# EAGLE schematic Freqy Lights Pro (EAGLE 6.6.0)
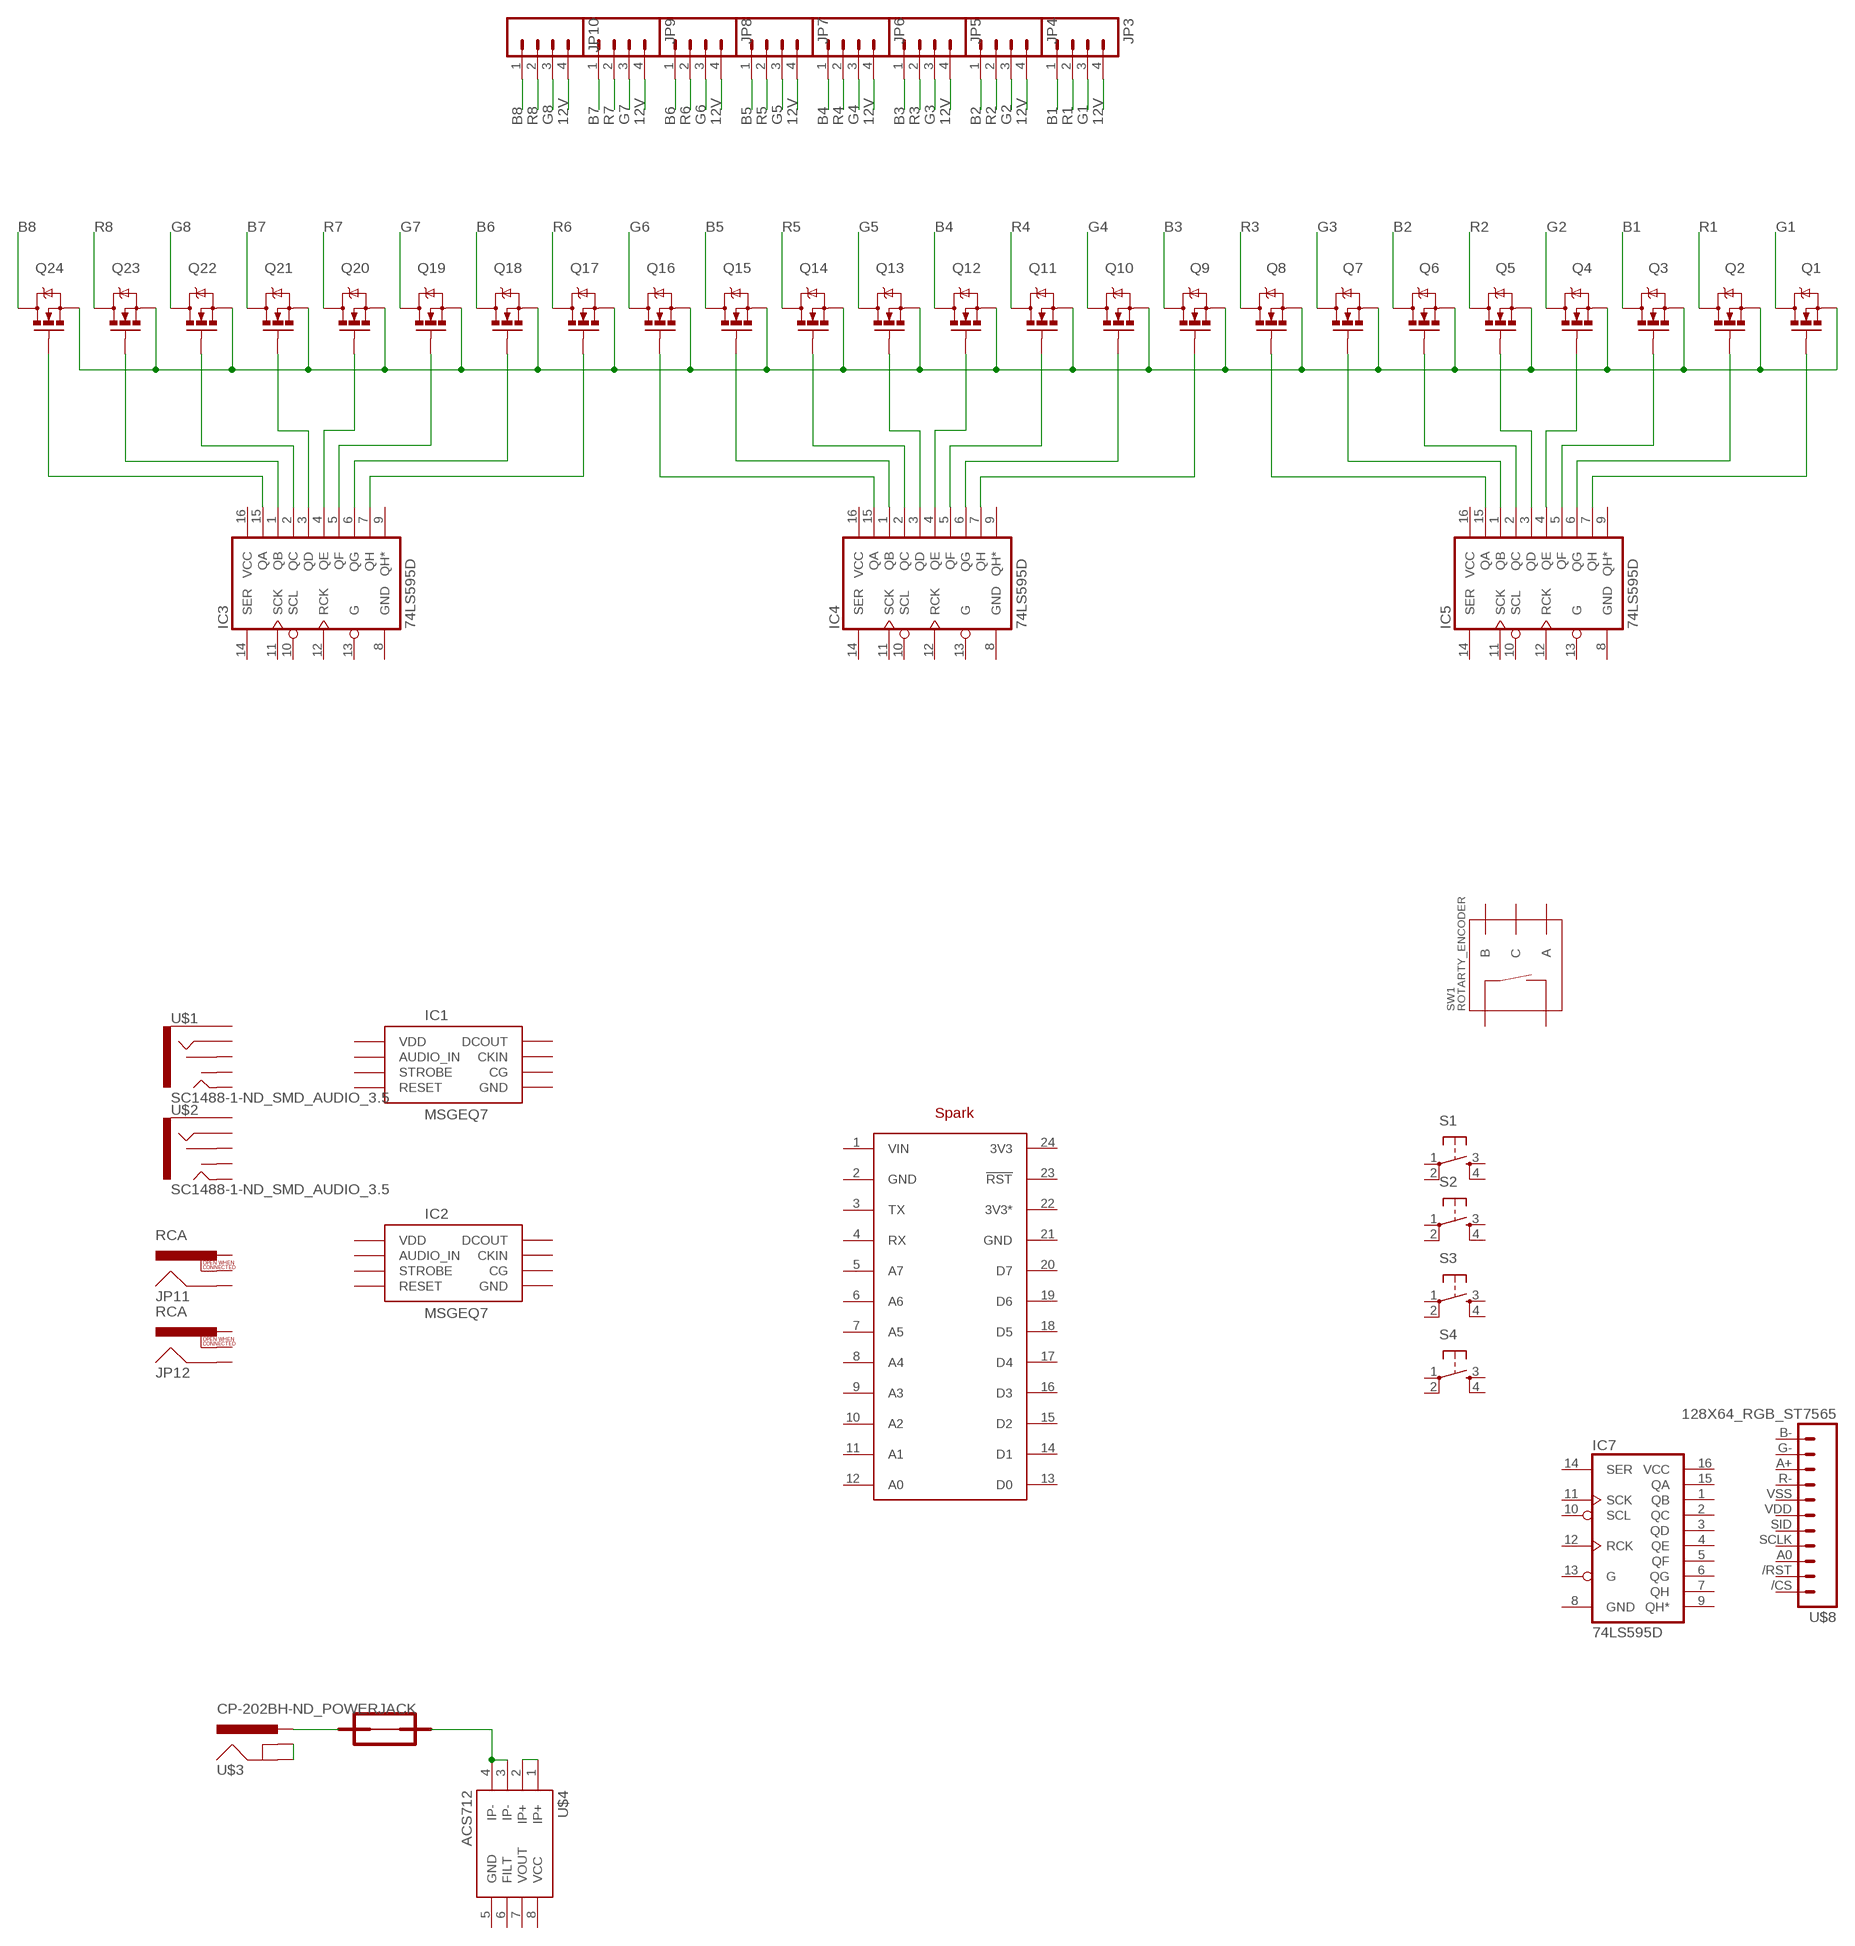
[diagram p0: schematic, sheet 1]

## Parts
IC1  MSGEQ7SOIC  [SOIC8]
IC2  MSGEQ7SOIC  [SOIC8]
IC3  74LS595D  [SO16]
IC4  74LS595D  [SO16]
IC5  74LS595D  [SO16]
IC7  74LS595D  [SO16]
JP3  M04SCREW  [SCREWTERMINAL-3.5MM-4]
JP4  M04SCREW  [SCREWTERMINAL-3.5MM-4]
JP5  M04SCREW  [SCREWTERMINAL-3.5MM-4]
JP6  M04SCREW  [SCREWTERMINAL-3.5MM-4]
JP7  M04SCREW  [SCREWTERMINAL-3.5MM-4]
JP8  M04SCREW  [SCREWTERMINAL-3.5MM-4]
JP9  M04SCREW  [SCREWTERMINAL-3.5MM-4]
JP10  M04SCREW  [SCREWTERMINAL-3.5MM-4]
JP11  RCA  [RCA]
JP12  RCA  [RCA]
Q1  MOSFET-NCHANNELBSS123LT1G  [SOT23]
Q2  MOSFET-NCHANNELBSS123LT1G  [SOT23]
Q3  MOSFET-NCHANNELBSS123LT1G  [SOT23]
Q4  MOSFET-NCHANNELBSS123LT1G  [SOT23]
Q5  MOSFET-NCHANNELBSS123LT1G  [SOT23]
Q6  MOSFET-NCHANNELBSS123LT1G  [SOT23]
Q7  MOSFET-NCHANNELBSS123LT1G  [SOT23]
Q8  MOSFET-NCHANNELBSS123LT1G  [SOT23]
Q9  MOSFET-NCHANNELBSS123LT1G  [SOT23]
Q10  MOSFET-NCHANNELBSS123LT1G  [SOT23]
Q11  MOSFET-NCHANNELBSS123LT1G  [SOT23]
Q12  MOSFET-NCHANNELBSS123LT1G  [SOT23]
Q13  MOSFET-NCHANNELBSS123LT1G  [SOT23]
Q14  MOSFET-NCHANNELBSS123LT1G  [SOT23]
Q15  MOSFET-NCHANNELBSS123LT1G  [SOT23]
Q16  MOSFET-NCHANNELBSS123LT1G  [SOT23]
Q17  MOSFET-NCHANNELBSS123LT1G  [SOT23]
Q18  MOSFET-NCHANNELBSS123LT1G  [SOT23]
Q19  MOSFET-NCHANNELBSS123LT1G  [SOT23]
Q20  MOSFET-NCHANNELBSS123LT1G  [SOT23]
Q21  MOSFET-NCHANNELBSS123LT1G  [SOT23]
Q22  MOSFET-NCHANNELBSS123LT1G  [SOT23]
Q23  MOSFET-NCHANNELBSS123LT1G  [SOT23]
Q24  MOSFET-NCHANNELBSS123LT1G  [SOT23]
S1  TAC_SWITCHPTH  [TACTILE-PTH]
S2  TAC_SWITCHPTH  [TACTILE-PTH]
S3  TAC_SWITCHPTH  [TACTILE-PTH]
S4  TAC_SWITCHPTH  [TACTILE-PTH]
SW1  ROTARTY_ENCODER  [ROTARY_ENC_PLAIN]
U$1  SC1488-1-ND_SMD_AUDIO_3.5  [3.5MM_SMD_AUDIO_SC1488-1-ND]
U$2  SC1488-1-ND_SMD_AUDIO_3.5  [3.5MM_SMD_AUDIO_SC1488-1-ND]
U$3  CP-202BH-ND_POWERJACK  [POWER_JACK_CP-202BH-ND]
U$4  ACS712  [SO08]
U$5  SSQ12  [SSQ12]
U$8  128X64_RGB_ST7565  [ST7565_128X64_RGB]
U$9  SPARK_LOGO_WITH_PLANE  [SPARK_LOGO_PLUS_PLANE]
U$10  SPARK_CORECORE  [SPARK_CORE]

## Nets
12V: JP3.4 JP4.4 JP5.4 JP6.4 JP7.4 JP8.4 JP9.4 JP10.4
B1: JP3.1 Q3.3(D)
B2: JP4.1 Q6.3(D)
B3: JP5.1 Q9.3(D)
B4: JP6.1 Q12.3(D)
B5: JP7.1 Q15.3(D)
B6: JP8.1 Q18.3(D)
B7: JP9.1 Q21.3(D)
B8: JP10.1 Q24.3(D)
G1: JP3.3 Q1.3(D)
G2: JP4.3 Q4.3(D)
G3: JP5.3 Q7.3(D)
G4: JP6.3 Q10.3(D)
G5: JP7.3 Q13.3(D)
G6: JP8.3 Q16.3(D)
G7: JP9.3 Q19.3(D)
G8: JP10.3 Q22.3(D)
N$1: Q1.2(S) Q2.2(S) Q3.2(S) Q4.2(S) Q5.2(S) Q6.2(S) Q7.2(S) Q8.2(S) Q9.2(S) Q10.2(S) Q11.2(S) Q12.2(S) Q13.2(S) Q14.2(S) Q15.2(S) Q16.2(S) Q17.2(S) Q18.2(S) Q19.2(S) Q20.2(S) Q21.2(S) Q22.2(S) Q23.2(S) Q24.2(S)
N$2: U$3.PWR U$5.P$1
N$3: U$3.GND U$3.GNDBRK(GNDBREAK)
N$5: U$4.3(IP-) U$4.4(IP-) U$5.P$2
N$6: IC3.15(QA) Q24.1(G)
N$7: IC3.1(QB) Q23.1(G)
N$8: IC3.2(QC) Q22.1(G)
N$9: IC3.3(QD) Q21.1(G)
N$10: IC3.4(QE) Q20.1(G)
N$11: IC3.5(QF) Q19.1(G)
N$12: IC3.6(QG) Q18.1(G)
N$13: IC3.7(QH) Q17.1(G)
N$14: IC4.3(QD) Q13.1(G)
N$15: IC4.4(QE) Q12.1(G)
N$16: IC5.3(QD) Q5.1(G)
N$17: IC5.4(QE) Q4.1(G)
N$18: IC4.15(QA) Q16.1(G)
N$19: IC4.1(QB) Q15.1(G)
N$20: IC4.2(QC) Q14.1(G)
N$21: IC4.5(QF) Q11.1(G)
N$22: IC4.6(QG) Q10.1(G)
N$23: IC4.7(QH) Q9.1(G)
N$24: IC5.15(QA) Q8.1(G)
N$25: IC5.1(QB) Q7.1(G)
N$26: IC5.2(QC) Q6.1(G)
N$27: IC5.7(QH) Q1.1(G)
N$28: IC5.6(QG) Q2.1(G)
N$29: IC5.5(QF) Q3.1(G)
N$30: U$4.1(IP+) U$4.2(IP+)
R1: JP3.2 Q2.3(D)
R2: JP4.2 Q5.3(D)
R3: JP5.2 Q8.3(D)
R4: JP6.2 Q11.3(D)
R5: JP7.2 Q14.3(D)
R6: JP8.2 Q17.3(D)
R7: JP9.2 Q20.3(D)
R8: JP10.2 Q23.3(D)
Unconnected: IC1.1(VDD) IC1.2(GND) IC1.3(DCOUT) IC1.4(STROBE) IC1.5(AUDIO_IN) IC1.6(CG) IC1.7(RESET) IC1.8(CKIN) IC2.1(VDD) IC2.2(GND) IC2.3(DCOUT) IC2.4(STROBE) IC2.5(AUDIO_IN) IC2.6(CG) IC2.7(RESET) IC2.8(CKIN) IC3.9(QH*) IC3.10(SCL) IC3.11(SCK) IC3.12(RCK) IC3.13(G) IC3.14(SER) IC4.9(QH*) IC4.10(SCL) IC4.11(SCK) IC4.12(RCK) IC4.13(G) IC4.14(SER) IC5.9(QH*) IC5.10(SCL) IC5.11(SCK) IC5.12(RCK) IC5.13(G) IC5.14(SER) IC7.1(QB) IC7.2(QC) IC7.3(QD) IC7.4(QE) IC7.5(QF) IC7.6(QG) IC7.7(QH) IC7.9(QH*) IC7.10(SCL) IC7.11(SCK) IC7.12(RCK) IC7.13(G) IC7.14(SER) IC7.15(QA) JP11.PIN JP11.SHELL JP11.SWITCH JP12.PIN JP12.SHELL JP12.SWITCH S1.1 S1.2 S1.3 S1.4 S2.1 S2.2 S2.3 S2.4 S3.1 S3.2 S3.3 S3.4 S4.1 S4.2 S4.3 S4.4 SW1.A SW1.B SW1.C SW1.SW+ SW1.SW- U$1.RING U$1.RSH U$1.SLEEVE U$1.TIP U$1.TSH U$2.RING U$2.RSH U$2.SLEEVE U$2.TIP U$2.TSH U$4.5(GND) U$4.6(FILT) U$4.7(VOUT) U$4.8(VCC) U$8./CS U$8./RST U$8.A0 U$8.A+ U$8.B- U$8.G- U$8.R- U$8.SCLK U$8.SID U$8.VDD U$8.VSS(GND) U$10.3(TX) U$10.4(RX) U$10.5(A7) U$10.6(A6) U$10.7(A5) U$10.8(A4) U$10.9(A3) U$10.10(A2) U$10.11(A1) U$10.12(A0) U$10.13(D0) U$10.14(D1) U$10.15(D2) U$10.16(D3) U$10.17(D4) U$10.18(D5) U$10.19(D6) U$10.20(D7) U$10.23(!RST)

## Power pins joined to a net without a drawn wire
3V3: U$10.24(3V3)
3V3*: U$10.22(3V3*)
GND: IC3.8(GND) IC4.8(GND) IC5.8(GND) IC7.8(GND) U$10.2(GND) U$10.21(GND)
VCC: IC3.16(VCC) IC4.16(VCC) IC5.16(VCC) IC7.16(VCC)
VIN: U$10.1(VIN)

## Library data of the parts
IC1 IC2 = SparkFun-AnalogIC:MSGEQ7: 7-band graphic equalizer
IC3-IC5 IC7 = SparkFun-DigitalIC:74*595: 8-bit SHIFT REGISTER, output latch
JP3-JP10 = SparkFun-Connectors:M04: Header 4 Standard 4-pin 0.1" header. Use with straight break away headers (SKU : PRT-00116), right angle break away headers (PRT-00553), swiss pins (PRT-00743), machine pins (PRT-00117), and female headers (PRT-00115). Molex polarized connector foot print use with SKU : PRT-08231 with associated crimp pins and housings. 1MM SMD Version SKU: PRT-10208
JP11 JP12 = SparkFun-Connectors:RCA
Q1-Q24 = SparkFun-DiscreteSemi:MOSFET-NCHANNEL: Common NMOSFET Parts MFG P/N Store ID Prod ID FDD8780 TRANS-09984 SI7820DN TRANS-11055 FDS6630A IC-08089 2N7002PW TRANS-11151 FQP30N06L COM-10213 TRANS-10060 BSS123LT1G TRANS-08345 BSS138 TRANS-00830 BS170 2N7000; PROD_ID: TRANS-08345
S1-S4 = SparkFun-Electromechanical:TAC_SWITCH: Momentary Switch Button commonly used for reset or general input. Spark Fun Electronics SKU : COM-00097 SMT- SWCH-08247
SW1 = SparkFun-Electromechanical:ROTARTY_ENCODER: Simple no LED rotary encoder Example: COM-09117
U$1 U$2 = SAUVE:SC1488-1-ND_SMD_AUDIO_3.5
U$3 = SAUVE:CP-202BH-ND_POWERJACK
U$4 = SparkFun-AnalogIC:ACS712: Hall-effect-based isolated linear current sensor
U$5 = SAUVE:SSQ12
U$8 = SAUVE:128X64_RGB_ST7565
U$9 = Spark:SPARK_LOGO_WITH_PLANE
U$10 = Spark:SPARK_CORE